# Altium schematic sheet 452006257#BDU控制板6-传感器及外部AD.SchDoc
size A3; SheetNumber: 14; SheetTotal: 14
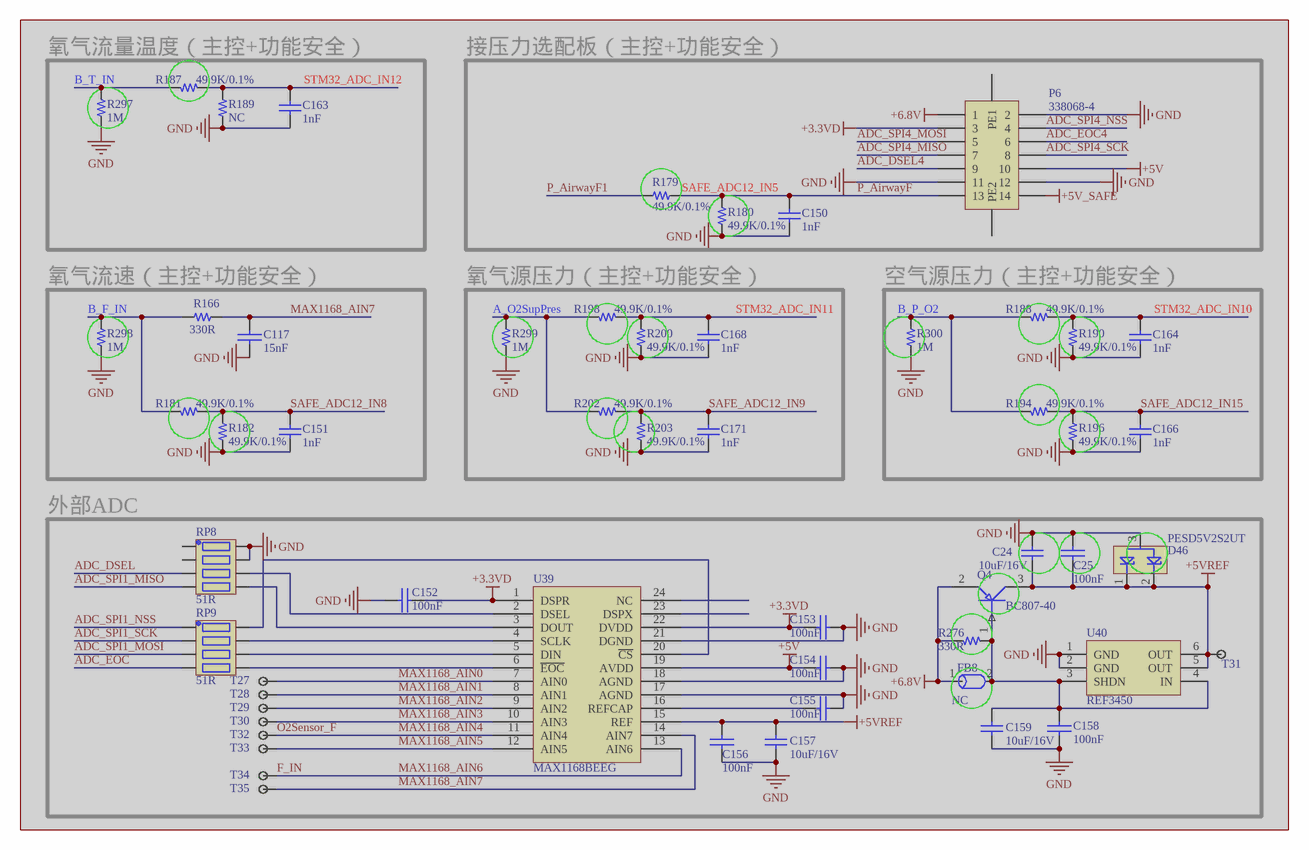
[diagram p0: 452006257#BDU控制板6-传感器及外部AD.SchDoc]

## Parts
C24  10uF/16V  [C-0805]  (masked out: inside a compile mask, not in the netlist)
C25  100nF  [C-0603]  (masked out: inside a compile mask, not in the netlist)
C117  15nF  [C-0603]  (masked out: inside a compile mask, not in the netlist)
C150  1nF  [C-0603]  (masked out: inside a compile mask, not in the netlist)
C151  1nF  [C-0603]  (masked out: inside a compile mask, not in the netlist)
C152  100nF  [C-0603]  (masked out: inside a compile mask, not in the netlist)
C153  100nF  [C-0603]  (masked out: inside a compile mask, not in the netlist)
C154  100nF  [C-0603]  (masked out: inside a compile mask, not in the netlist)
C155  100nF  [C-0603]  (masked out: inside a compile mask, not in the netlist)
C156  100nF  [C-0603]  (masked out: inside a compile mask, not in the netlist)
C157  10uF/16V  [C-0805]  (masked out: inside a compile mask, not in the netlist)
C158  100nF  [C-0603]  (masked out: inside a compile mask, not in the netlist)
C159  10uF/16V  [C-0805]  (masked out: inside a compile mask, not in the netlist)
C163  1nF  [C-0603]  (masked out: inside a compile mask, not in the netlist)
C164  1nF  [C-0603]  (masked out: inside a compile mask, not in the netlist)
C166  1nF  [C-0603]  (masked out: inside a compile mask, not in the netlist)
C168  1nF  [C-0603]  (masked out: inside a compile mask, not in the netlist)
C171  1nF  [C-0603]  (masked out: inside a compile mask, not in the netlist)
D46  PESD5V2S2UT  [sot23-3]  (masked out: inside a compile mask, not in the netlist)
FB8  NC  [R-0805]  (masked out: inside a compile mask, not in the netlist)
P6  338068-4  [选配食道压]  (masked out: inside a compile mask, not in the netlist)
Q4  BC807-40  [SOT23-3]  (masked out: inside a compile mask, not in the netlist)
R166  330R  [R-0603]  (masked out: inside a compile mask, not in the netlist)
R179  49.9K/0.1%  [R-0603]  (masked out: inside a compile mask, not in the netlist)
R180  49.9K/0.1%  [R-0603]  (masked out: inside a compile mask, not in the netlist)
R181  49.9K/0.1%  [R-0603]  (masked out: inside a compile mask, not in the netlist)
R182  49.9K/0.1%  [R-0603]  (masked out: inside a compile mask, not in the netlist)
R187  49.9K/0.1%  [R-0603]  (masked out: inside a compile mask, not in the netlist)
R188  49.9K/0.1%  [R-0603]  (masked out: inside a compile mask, not in the netlist)
R189  NC  [R-0603]  (masked out: inside a compile mask, not in the netlist)
R190  49.9K/0.1%  [R-0603]  (masked out: inside a compile mask, not in the netlist)
R194  49.9K/0.1%  [R-0603]  (masked out: inside a compile mask, not in the netlist)
R196  49.9K/0.1%  [R-0603]  (masked out: inside a compile mask, not in the netlist)
R198  49.9K/0.1%  [R-0603]  (masked out: inside a compile mask, not in the netlist)
R200  49.9K/0.1%  [R-0603]  (masked out: inside a compile mask, not in the netlist)
R202  49.9K/0.1%  [R-0603]  (masked out: inside a compile mask, not in the netlist)
R203  49.9K/0.1%  [R-0603]  (masked out: inside a compile mask, not in the netlist)
R276  330R  [R-0805]  (masked out: inside a compile mask, not in the netlist)
R297  1M  [R-0603]  (masked out: inside a compile mask, not in the netlist)
R298  1M  [R-0603]  (masked out: inside a compile mask, not in the netlist)
R299  1M  [R-0603]  (masked out: inside a compile mask, not in the netlist)
R300  1M  [R-0603]  (masked out: inside a compile mask, not in the netlist)
RP8  51R  [RP-0603]  (masked out: inside a compile mask, not in the netlist)
RP9  51R  [RP-0603]  (masked out: inside a compile mask, not in the netlist)
T27  直插测试点  [DIPTP]  (value not drawn)  (masked out: inside a compile mask, not in the netlist)
T28  直插测试点  [DIPTP]  (value not drawn)  (masked out: inside a compile mask, not in the netlist)
T29  直插测试点  [DIPTP]  (value not drawn)  (masked out: inside a compile mask, not in the netlist)
T30  直插测试点  [DIPTP]  (value not drawn)  (masked out: inside a compile mask, not in the netlist)
T31  直插测试点  [DIPTP]  (value not drawn)  (masked out: inside a compile mask, not in the netlist)
T32  直插测试点  [DIPTP]  (value not drawn)  (masked out: inside a compile mask, not in the netlist)
T33  直插测试点  [DIPTP]  (value not drawn)  (masked out: inside a compile mask, not in the netlist)
T34  直插测试点  [DIPTP]  (value not drawn)  (masked out: inside a compile mask, not in the netlist)
T35  直插测试点  [DIPTP]  (value not drawn)  (masked out: inside a compile mask, not in the netlist)
U39  MAX1168BEEG  [QSOP-24]  (masked out: inside a compile mask, not in the netlist)
U40  REF3450  [SOT23-6]  (masked out: inside a compile mask, not in the netlist)

## Blocks framed on the sheet
氧气流量温度（主控+功能安全）: C163 R187 R189 R297
接压力选配板（主控+功能安全）: C150 P6 R179 R180
氧气流速（主控+功能安全）: C117 C151 R166 R181 R182 R298
氧气源压力（主控+功能安全）: C168 C171 R198 R200 R202 R203 R299
空气源压力（主控+功能安全）: C164 C166 R188 R190 R194 R196 R300
外部ADC: C24 C25 C152-C159 D46 FB8 Q4 R276 RP8 RP9 T27-T35 U39 U40

## Notes on the sheet
- 1
- 2
- 3
- 4
- 5
- 6
- 7
- 8
- A
- B
- C
- D
- 更改单号
- 共   页      第    页
- 标记
- 签字、日期

## Library data of the parts
C24 C157 C159 = 100nF_1: 贴片瓷介电容100nF±5%,0805; 物料编号: 210001894; 详细描述: X7R,50V,三星CL21B104JBCNNNC; 版本: V1.00; 制造商: 三星; 名称: 贴片瓷介电容100nF±5%,0805
C25 C117 C152-C156 C158 = CAP: Capacitor
C150 C151 C163 C164 C166 C168 C171 = C-0603: 物料编号: *; 物料名称: *; 厂家: *; 详细描述: *
D46 = PESDxS2UT
FB8 = FB_1K/500mA_0805: Rdc0.3Ω,伍尔特,742792032; 名称: 贴片磁珠1K/500mA，0805; 版本: V1.00; 物料编号: 210001925; 详细描述: Rdc0.3,R材料,TDK MMZ2012R102A; 制造商: TDK
P6 = Header 7X2: Header, 7-Pin, Dual row; LatestRevisionDate: 17-Jul-2002; LatestRevisionNote: Re-released for DXP Platform.; Publisher: Altium Limited
Q4 = BC807-40: 版本: V1.00; 物料编号: *; 详细描述: *
R166 R297-R300 = R-0603
R179 R180 R182 R189 R190 R196 R200 R203 = 3.3K_1: 国巨RC0805FR-073K3; 物料编号: 210001835; 详细描述: 0805,1/8W,国巨RC0805FR-073K3; 制造商: 国巨; 版本: V1.00; 名称: 贴片电阻3.3K±1%
R181 R187 R188 R194 R198 R202 R276 = 100Ω_1: 国巨RC0805FR-07100R; 物料编号: 210000765; 详细描述: 0805,1/8W,国巨RC0805FR-07100R; 制造商: 国巨; 版本: V1.00; 名称: 贴片电阻100±1%
RP8 RP9 = RP-0603
T27-T35 = Testpiont: 版本: V1.00; 名称: 直插测试点
U39 = MAX1167
U40 = REF3225